# Altium schematic sheet Electronic load 1.0.SchDoc
size A4; Engineer: T.Wadolowski; Address1: Whitehill Sp.z o.o Sp.k; Address4: ul.Żurawia 71; DocumentNumber: 1.0
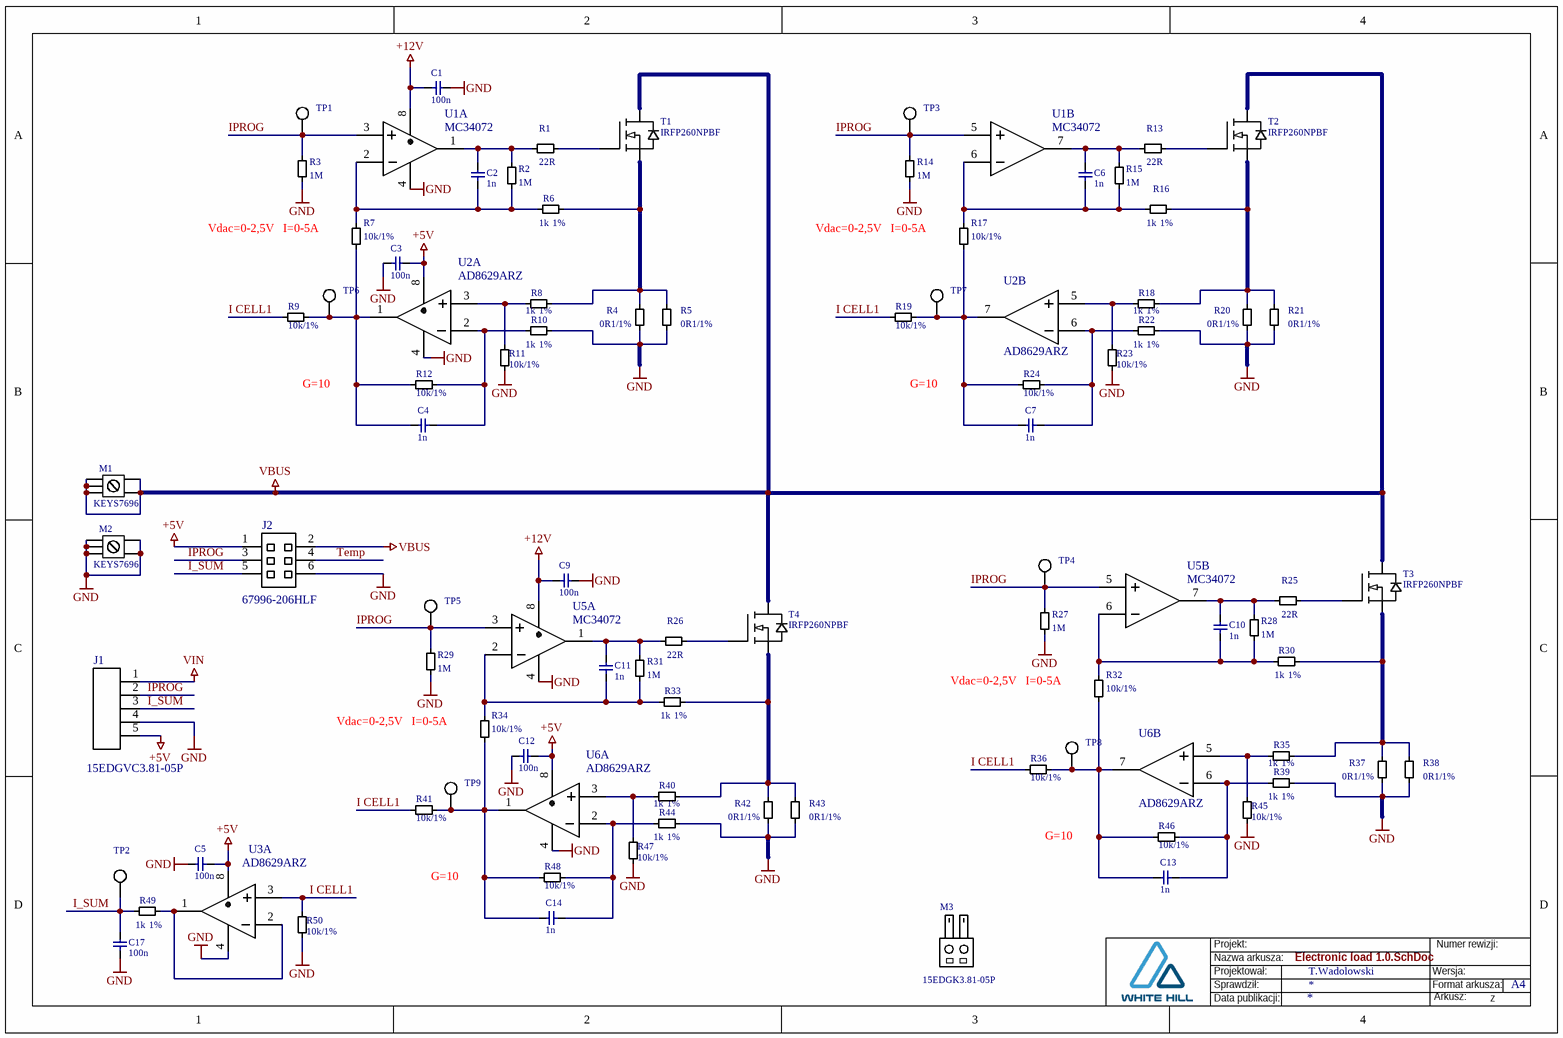
[diagram p0: Electronic load 1.0.SchDoc]

## Parts
C1  100n  [C0603]
C2  1n  [C0603]
C3  100n  [C0603]
C4  1n  [C0603]
C5  100n  [C0603]
C6  1n  [C0603]
C7  1n  [C0603]
C9  100n  [C0603]
C10  1n  [C0603]
C11  1n  [C0603]
C12  100n  [C0603]
C13  1n  [C0603]
C14  1n  [C0603]
C17  100n  [C0603]
J1  15EDGVC3.81-05P  [MCV1,5/5-G3,81]
J2  67996-206HLF  [GP2x3]
M1  KEYS7696  [KEY-7696]
M2  KEYS7696  [KEY-7696]
M3  15EDGK3.81-05P  (mechanical)
R1  22R  [R0603]
R2  1M  [R0603]
R3  1M  [R0603]
R4  0R1/1%  [R2512]
R5  0R1/1%  [R2512]
R6  1k  Tolerance: 1%  [R0603]
R7  10k/1%  [R0603]
R8  1k  Tolerance: 1%  [R0603]
R9  10k/1%  [R0603]
R10  1k  Tolerance: 1%  [R0603]
R11  10k/1%  [R0603]
R12  10k/1%  [R0603]
R13  22R  [R0603]
R14  1M  [R0603]
R15  1M  [R0603]
R16  1k  Tolerance: 1%  [R0603]
R17  10k/1%  [R0603]
R18  1k  Tolerance: 1%  [R0603]
R19  10k/1%  [R0603]
R20  0R1/1%  [R2512]
R21  0R1/1%  [R2512]
R22  1k  Tolerance: 1%  [R0603]
R23  10k/1%  [R0603]
R24  10k/1%  [R0603]
R25  22R  [R0603]
R26  22R  [R0603]
R27  1M  [R0603]
R28  1M  [R0603]
R29  1M  [R0603]
R30  1k  Tolerance: 1%  [R0603]
R31  1M  [R0603]
R32  10k/1%  [R0603]
R33  1k  Tolerance: 1%  [R0603]
R34  10k/1%  [R0603]
R35  1k  Tolerance: 1%  [R0603]
R36  10k/1%  [R0603]
R37  0R1/1%  [R2512]
R38  0R1/1%  [R2512]
R39  1k  Tolerance: 1%  [R0603]
R40  1k  Tolerance: 1%  [R0603]
R41  10k/1%  [R0603]
R42  0R1/1%  [R2512]
R43  0R1/1%  [R2512]
R44  1k  Tolerance: 1%  [R0603]
R45  10k/1%  [R0603]
R46  10k/1%  [R0603]
R47  10k/1%  [R0603]
R48  10k/1%  [R0603]
R49  1k  Tolerance: 1%  [R0603]
R50  10k/1%  [R0603]
T1  IRFP260NPBF  [TO-247-HOR]
T2  IRFP260NPBF  [TO-247-HOR]
T3  IRFP260NPBF  [TO-247-HOR]
T4  IRFP260NPBF  [TO-247-HOR]
TP1  TP  [TP]  (value not drawn)  (no BOM)
TP2  TP  [TP]  (value not drawn)  (no BOM)
TP3  TP  [TP]  (value not drawn)  (no BOM)
TP4  TP  [TP]  (value not drawn)  (no BOM)
TP5  TP  [TP]  (value not drawn)  (no BOM)
TP6  TP  [TP]  (value not drawn)  (no BOM)
TP7  TP  [TP]  (value not drawn)  (no BOM)
TP8  TP  [TP]  (value not drawn)  (no BOM)
TP9  TP  [TP]  (value not drawn)  (no BOM)
U1  MC34072  [SO-8]  (parts A,B of 2)
U2  AD8629ARZ  [SO-8]  (parts A,B of 2)
U3  AD8629ARZ  [SO-8]  (part A of 2)
U5  MC34072  [SO-8]  (parts A,B of 2)
U6  AD8629ARZ  [SO-8]  (parts A,B of 2)

## Nets
+5V: C3.1 C5.2 C12.1 J1.5 J2.1 U2.8(V+) U3.8(V+) U6.8(V+)
+12V: C1.2 C9.2 U1.8(V+) U5.8(V+)
GND: C1.1 C3.2 C5.1 C9.1 C12.2 C17.2 J1.4 J2.6 M2.1 M2.2 M2.3 M2.4 M2.5 R3.1(TOP) R4.2(BOT) R5.2(BOT) R10.1(TOP) R11.2(BOT) R14.1(TOP) R20.2(BOT) R21.2(BOT) R22.1(TOP) R23.2(BOT) R27.1(TOP) R29.1(TOP) R37.2(BOT) R38.2(BOT) R39.1(TOP) R42.2(BOT) R43.2(BOT) R44.1(TOP) R45.2(BOT) R47.2(BOT) R50.1(TOP) U1.4(V-) U2.4(V-) U3.4(V-) U5.4(V-) U6.4(V-)
VBUS: J2.2 M1.1 M1.2 M1.3 M1.4 M1.5 T1.2(D) T2.2(D) T3.2(D) T4.2(D)
VIN: J1.1
\: C17.1 J1.3 J2.5 R49.2(BOT) TP2.1  [also labelled I_SUM]
I CELL1: R9.1(TOP) R19.1(TOP) R36.1(TOP) R41.1(TOP) R50.2(BOT) U3.3(1IN+)
IPROG: J1.2 J2.3 R3.2(BOT) R14.2(BOT) R27.2(BOT) R29.2(BOT) TP1.1 TP3.1 TP4.1 TP5.1 U1.3(1IN+) U1.5(2IN+) U5.3(1IN+) U5.5(2IN+)
Temp: J2.4
NetC2_1: C2.1 R1.1(TOP) R2.2(BOT) U1.1(1OUT)
NetC2_2: C2.2 R2.1(TOP) R6.2(BOT) R7.2(BOT) U1.2(1IN-)
NetC4_1: C4.1 R7.1(TOP) R9.2(BOT) R12.2(BOT) TP6.1 U2.1(1OUT)
NetC4_2: C4.2 R10.2(BOT) R12.1(TOP) U2.2(1IN-)
NetC6_1: C6.1 R13.1(TOP) R15.2(BOT) U1.7(2OUT)
NetC6_2: C6.2 R15.1(TOP) R16.2(BOT) R17.2(BOT) U1.6(2IN-)
NetC7_1: C7.1 R17.1(TOP) R19.2(BOT) R24.2(BOT) TP7.1 U2.7(2OUT)
NetC7_2: C7.2 R22.2(BOT) R24.1(TOP) U2.6(2IN-)
NetC10_1: C10.1 R25.1(TOP) R28.2(BOT) U5.7(2OUT)
NetC10_2: C10.2 R28.1(TOP) R30.2(BOT) R32.2(BOT) U5.6(2IN-)
NetC11_1: C11.1 R26.1(TOP) R31.2(BOT) U5.1(1OUT)
NetC11_2: C11.2 R31.1(TOP) R33.2(BOT) R34.2(BOT) U5.2(1IN-)
NetC13_1: C13.1 R32.1(TOP) R36.2(BOT) R46.2(BOT) TP8.1 U6.7(2OUT)
NetC13_2: C13.2 R39.2(BOT) R46.1(TOP) U6.6(2IN-)
NetC14_1: C14.1 R34.1(TOP) R41.2(BOT) R48.2(BOT) TP9.1 U6.1(1OUT)
NetC14_2: C14.2 R44.2(BOT) R48.1(TOP) U6.2(1IN-)
NetR1_2: R1.2(BOT) T1.1(G)
NetR4_1: R4.1(TOP) R5.1(TOP) R6.1(TOP) R8.1(TOP) T1.3(S)
NetR8_2: R8.2(BOT) R11.1(TOP) U2.3(1IN+)
NetR13_2: R13.2(BOT) T2.1(G)
NetR16_1: R16.1(TOP) R18.1(TOP) R20.1(TOP) R21.1(TOP) T2.3(S)
NetR18_2: R18.2(BOT) R23.1(TOP) U2.5(2IN+)
NetR25_2: R25.2(BOT) T3.1(G)
NetR26_2: R26.2(BOT) T4.1(G)
NetR30_1: R30.1(TOP) R35.1(TOP) R37.1(TOP) R38.1(TOP) T3.3(S)
NetR33_1: R33.1(TOP) R40.1(TOP) R42.1(TOP) R43.1(TOP) T4.3(S)
NetR35_2: R35.2(BOT) R45.1(TOP) U6.5(2IN+)
NetR40_2: R40.2(BOT) R47.1(TOP) U6.3(1IN+)
NetR49_1: R49.1(TOP) U3.1(1OUT) U3.2(1IN-)

## Notes on the sheet
- (near R7) Vdac=0-2,5V   I=0-5A
- (near R17) Vdac=0-2,5V   I=0-5A
- G=10
- (near R32) Vdac=0-2,5V   I=0-5A
- (near R34) Vdac=0-2,5V   I=0-5A
- Projektował:
- Sprawdził:
- Projekt:
- Nazwa arkusza:
- Wersja:
- Format arkusza:
- Numer rewizji:
- A4
- Data publikacji:
- Arkusz:
- z

## Library data of the parts
C1 C3 C5 C9 C12 C17 = C-013: Capacitor: ceramic; 100nF; 50V; X7R; ±10%; SMD; 0603; Series: GRM; Manufacturer: Murata; Part Number: GRM188R71H104KA93D; Indeks: C-0013; Value: 100n; ComponentLink1Description: Datasheet; ComponentLink1URL: D:\Datasheets\.pdf; Supplier: TME; Supplier Code: GRM188R71H104KA93D; ComponentLink2Description: Dostawca; ComponentLink2URL: http://www.tme.eu/pl/katalog/?idp=1&search=GRM188R71H104KA93D
C2 C4 C6 C7 C10 C11 C13 C14 = C-006: Capacitor: ceramic; MLCC; 1nF; 50V; X7R; ±10%; SMD; 0603; Manufacturer: Vishay; Part Number: VJ0603Y102KXACW1BC; Value: 1n; ComponentLink1Description: Datasheet; ComponentLink1URL: D:\Datasheets\.pdf; Supplier: TME; Supplier Code: VJ0603Y102KXACW1BC; Indeks: C-006; ComponentLink2Description: Dostawca; ComponentLink2URL: http://www.tme.eu/pl/katalog/?idp=1&search=VJ0603Y102KXACW1BC
J1 = CON5: Pluggable terminal block; 3.81mm; ways:5; straight; socket; male; Part Number: 15EDGVC-3.81-05P-14-00A(H); Value: 15EDGVC3.81-05P; ComponentLink1Description: Datasheet; ComponentLink1URL: D:\Datasheets\.pdf; Supplier: TME; Supplier Code: 15EDGVC3.81-05P; ComponentLink2Description: Dostawca
J2 = CON2x3: Pin header; pin strips; male;2.54mm; PIN:6; THT; Manufacturer: Amphenol; Value: 67996-206HLF; ComponentLink1Description: Datasheet; ComponentLink1URL: D:\Datasheets\.pdf; Part Number: 67996-206HLF; Supplier: TME; Supplier Code: 67996-206HLF; ComponentLink2Description: Dostawca
M1 M2 = M3 pcb: Terminal: screw terminal; THT, screw terminal; silver; 7x5mm; Manufacturer: Keystone; Part Number: 7696; Value: KEYS7696; ComponentLink1Description: Datasheet; ComponentLink1URL: E:\Datasheets\7696.pdf; Supplier: TME; Supplier Code: KEYS7696; ComponentLink2Description: Dostawca
M3 = Wtyk 3,81: Pluggable terminal block; 3.81mm; ways:5; straight; plug; female; Part Number: 15EDGK-3.81-05P-14-00A(H); Value: 15EDGK3.81-05P; ComponentLink1Description: Datasheet; ComponentLink1URL: D:\Datasheets\.pdf; Supplier: TME; Supplier Code: 15EDGK3.81-05P; ComponentLink2Description: Dostawca
R1 R13 R25 R26 = R-002: Resistor: thick film; SMD; 0603; 22R; 0.1W; ±5%;; Manufacturer: Royal Ohm; Part Number: 0603SAJ0220T5E; Value: 22R; ComponentLink1Description: Datasheet; ComponentLink1URL: D:\Datasheets\.pdf; Supplier: TME; Supplier Code: SMD0603-22R; Indeks: R-002; ComponentLink2Description: Dostawca; ComponentLink2URL: http://www.tme.eu/pl/katalog/?idp=1&search=SMD0603-22R; Tolerance: 5%
R2 R3 R14 R15 R27-R29 R31 = R-022: Resistor: thick film; SMD; 0603; 1M; 0.1W; ±5%;; Manufacturer: Royal Ohm; Part Number: 0603SAJ0105T5E; Value: 1M; ComponentLink1Description: Datasheet; ComponentLink1URL: D:\Datasheets\.pdf; Supplier: VISHAY; Supplier Code: SMD0603-1M; Indeks: R-022; ComponentLink2Description: Dostawca; ComponentLink2URL: http://www.tme.eu/pl/katalog/?idp=1&search=SMD0603-1M; Tolerance: 5%
R4 R5 R20 R21 R37 R38 R42 R43 = R: Rezystor: pomiarowy; SMD; 2512; 100mOhm; 3W; ±1%; 50ppm; Manufacturer: Viking; Part Number: LPR12FTDRR100; Value: 0R1/1%; ComponentLink1Description: Datasheet; ComponentLink1URL: D:\Datasheets\Viking-LRP.pdf; Supplier: TME; Supplier Code: LRP2512-R100-1%; ComponentLink2Description: Dostawca; ComponentLink2URL: http://www.tme.eu/pl/katalog/?idp=1&search=LRP2512-R100-1%
R6 R8 R10 R16 R18 R22 R30 R33 R35 R39 R40 R44 R49 = R-035: Resistor: thick film; SMD; 0603; 1k; 0.1W; ±1%; Manufacturer: Royal Ohm; Part Number: 0603SAF1001T5E; Value: 1k; ComponentLink1Description: Datasheet; ComponentLink1URL: D:\Datasheets\.pdf; Supplier: TME; Supplier Code: SMD0603-1K-1%; Indeks: R-035; ComponentLink2Description: Dostawca; ComponentLink2URL: http://www.tme.eu/pl/katalog/?idp=1&search=WW25RR005FTL
R7 R9 R11 R12 R17 R19 R23 R24 R32 R34 R36 R41 R45-R48 R50 = R: Rezystor: thick film; SMD; 0603; 10kOhm; 0,1W; ±1%; -55÷155°C; Manufacturer: VISHAY; Part Number: CRCW060310K0FKTABC; Value: 10k/1%; ComponentLink1Description: Datasheet; ComponentLink1URL: D:\Datasheets\.pdf; Supplier: TME; Supplier Code: CRCW060310K0FKTABC; ComponentLink2Description: Dostawca
T1-T4 = IRFP260NPBF: Tranzystor: N-MOSFET; unipolarny; HEXFET; 200V; 35A; 300W; TO247AC; Manufacturer: Infineon; Indeks: TRAN; Value: IRFP260NPBF; Supplier: TME; Supplier Code: IRFP260NPBF; ComponentLink1Description: Datasheet; ComponentLink1URL: D:\Datasheets\IRF7342.pdf; Part Number: IRFP260NPBF; ComponentLink2Description: Dostawca; ComponentLink2URL: http://www.tme.eu/pl/katalog/?idp=1&search=IRFZ34NPBF
TP1-TP9 = TP: Test point; ComponentLink1Description: Datasheet; ComponentLink1URL: D:\Datasheets\.pdf; ComponentLink2Description: Dostawca
U1 U5 = MC34072: Operational Amplifier Dual;4,5MHz,3-44V,SOIC-8; Manufacturer: TI; Part Number: MC34072ADG; Value: MC34072; ComponentLink1Description: Datasheet; ComponentLink1URL: D:\Datasheets\MC34072.pdf; Supplier: Farnell; Supplier Code: 1426371; ComponentLink2Description: Dostawca; ComponentLink2URL: http://pl.farnell.com//1426371
U2 U3 U6 = AD8629: Zero-Drift, Single-Supply, Rail-to-Rail  Input/Output Operational Amplifier; Manufacturer: Analog Devices; Value: AD8629ARZ; ComponentLink1Description: Datasheet; ComponentLink1URL: D:\Datasheets\AD8629.pdf; Part Number: AD8629ARZ; Supplier: Farnell; Supplier Code: 9994300; ComponentLink2Description: Dostawca; ComponentLink2URL: http://pl.farnell.com//9994300